# EAGLE schematic usb_power (EAGLE 7.1.0)
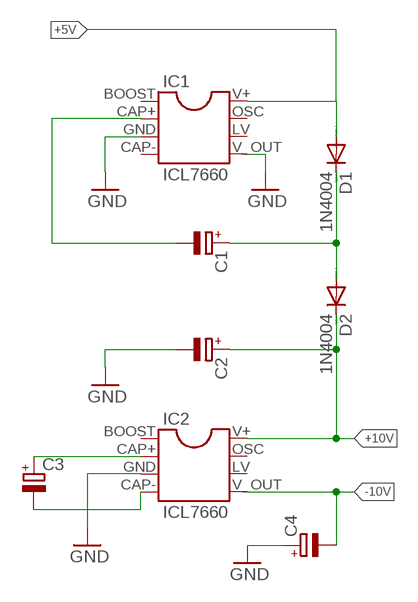
[diagram p0: schematic, sheet 1]

## Parts
C1  CPOL-EUE2-4  [E2-4]
C2  CPOL-EUE2-4  [E2-4]
C3  CPOL-EUE2-4  [E2-4]
C4  CPOL-EUE2-4  [E2-4]
D1  1N4004  [DO41-10]
D2  1N4004  [DO41-10]
IC1  ICL7660  DIL8  [DIL08]
IC2  ICL7660  DIL8  [DIL08]

## Nets
+5V: D1.A IC1.V+
+10V: C2.+ D2.C IC2.V+
-10V: C4.- IC2.V_OUT
GND: C2.- C4.+ IC1.GND IC1.V_OUT IC2.GND
N$1: C1.- IC1.CAP+
N$3: C1.+ D1.C D2.A
N$5: C3.+ IC2.CAP+
N$6: C3.- IC2.CAP-
Unconnected: IC1.BOOST IC1.CAP- IC1.LV IC1.OSC IC2.BOOST IC2.LV IC2.OSC

## Library data of the parts
C1-C4 = rcl:CPOL-EU: POLARIZED CAPACITOR, European symbol
D1 D2 = diode:1N4004: DIODE general purpose rectifier, 1 A
IC1 IC2 = icl7660:DIL8: Dual In Line / Socket